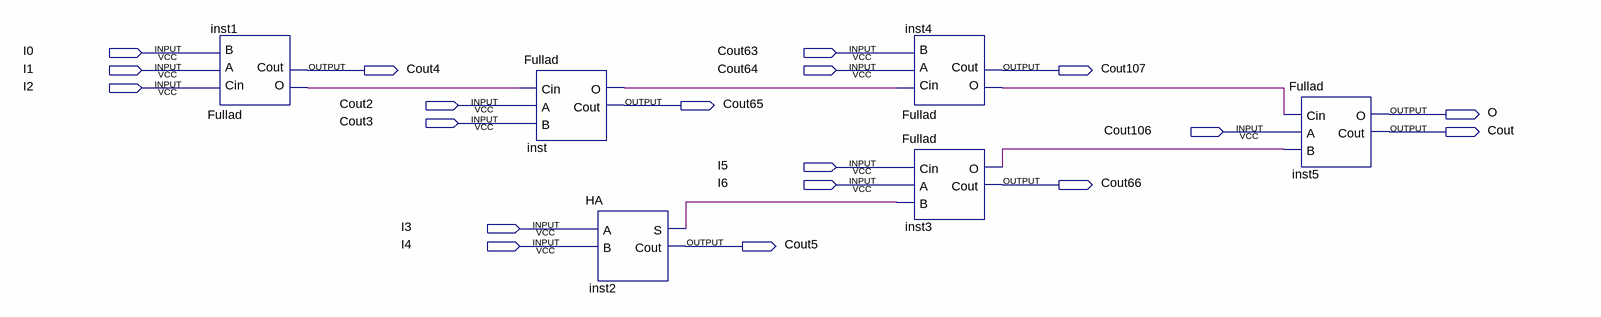
[diagram p0: schematic sheet]
// Quartus schematic B13.bdf as structural Verilog: 6 symbols, 19 pins
module B13 (
  input  I0,
  input  Cout63,
  input  I1,
  input  Cout64,
  input  I2,
  input  Cout2,
  input  Cout3,
  input  Cout106,
  input  I5,
  input  I6,
  input  I3,
  input  I4,
  output Cout4,
  output Cout107,
  output Cout65,
  output O,
  output Cout,
  output Cout66,
  output Cout5
);

  wire inst1_o, inst2_s, inst3_o, inst4_o, inst_o;

  Fullad inst1 (.Cin(I2), .A(I1), .B(I0), .O(inst1_o), .Cout(Cout4));
  Fullad inst (.Cin(inst1_o), .A(Cout2), .B(Cout3), .O(inst_o), .Cout(Cout65));
  HA inst2 (.A(I3), .B(I4), .S(inst2_s), .Cout(Cout5));
  Fullad inst4 (.Cin(inst_o), .A(Cout64), .B(Cout63), .O(inst4_o), .Cout(Cout107));
  Fullad inst3 (.Cin(I5), .A(I6), .B(inst2_s), .O(inst3_o), .Cout(Cout66));
  Fullad inst5 (.Cin(inst4_o), .A(Cout106), .B(inst3_o), .O(O), .Cout(Cout));
endmodule
